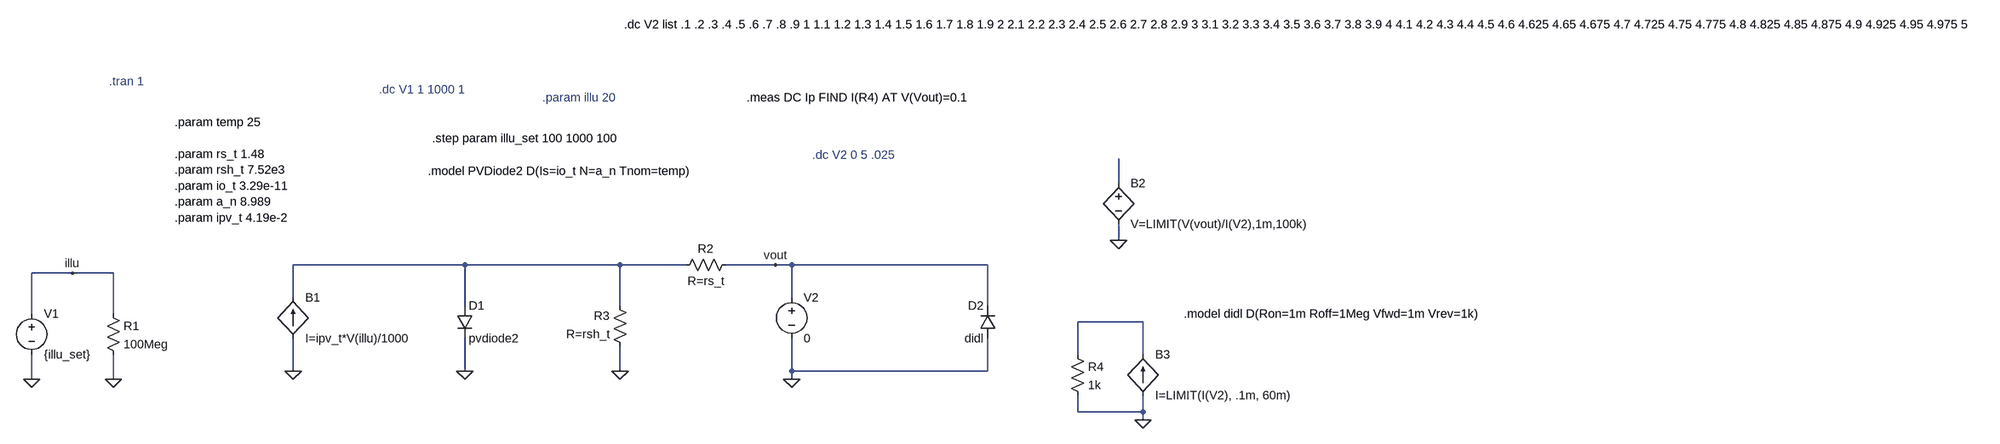
[diagram p0: schematic SM101K07L_Model.asc]
SM101K07L_Model.asc, the LTspice schematic file:
Version 4
SHEET 1 4508 756
WIRE 2256 -80 2256 -128
WIRE 2256 32 2256 0
WIRE 976 80 640 80
WIRE 1280 80 976 80
WIRE 1408 80 1280 80
WIRE 1584 80 1488 80
WIRE 1616 80 1584 80
WIRE 2000 80 1616 80
WIRE 208 96 128 96
WIRE 288 96 208 96
WIRE 640 144 640 80
WIRE 1616 144 1616 80
WIRE 976 160 976 80
WIRE 1280 160 1280 80
WIRE 2000 160 2000 80
WIRE 128 176 128 96
WIRE 288 176 288 96
WIRE 2304 192 2176 192
WIRE 2176 256 2176 192
WIRE 2304 256 2304 192
WIRE 640 288 640 224
WIRE 976 288 976 224
WIRE 1280 288 1280 240
WIRE 1616 288 1616 224
WIRE 2000 288 2000 224
WIRE 2000 288 1616 288
WIRE 128 304 128 256
WIRE 288 304 288 256
WIRE 1616 304 1616 288
WIRE 2176 368 2176 336
WIRE 2304 368 2304 336
WIRE 2304 368 2176 368
WIRE 2304 384 2304 368
FLAG 128 304 0
FLAG 288 304 0
FLAG 208 96 illu
FLAG 1616 304 0
FLAG 1280 288 0
FLAG 976 288 0
FLAG 640 288 0
FLAG 1584 80 vout
FLAG 2256 32 0
FLAG 2304 384 0
SYMBOL voltage 128 160 R0
WINDOW 123 0 0 Left 0
WINDOW 39 0 0 Left 0
SYMATTR InstName V1
SYMATTR Value {illu_set}
SYMBOL res 272 160 R0
SYMATTR InstName R1
SYMATTR Value 100Meg
SYMBOL res 1504 64 R90
WINDOW 0 0 56 VBottom 2
WINDOW 3 32 56 VTop 2
SYMATTR InstName R2
SYMATTR Value R=rs_t
SYMBOL res 1296 256 R180
WINDOW 0 36 76 Left 2
WINDOW 3 36 40 Left 2
SYMATTR InstName R3
SYMATTR Value R=rsh_t
SYMBOL diode 960 160 R0
SYMATTR InstName D1
SYMATTR Value pvdiode2
SYMBOL bi2 640 144 R0
SYMATTR InstName B1
SYMATTR Value I=ipv_t*V(illu)/1000
SYMBOL diode 2016 224 R180
WINDOW 0 24 64 Left 2
WINDOW 3 24 0 Left 2
SYMATTR InstName D2
SYMATTR Value didl
SYMBOL bv 2256 -96 R0
SYMATTR InstName B2
SYMATTR Value V=LIMIT(V(vout)/I(V2),1m,100k)
SYMBOL voltage 1616 128 R0
WINDOW 123 0 0 Left 0
WINDOW 39 0 0 Left 0
SYMATTR InstName V2
SYMATTR Value 0
SYMBOL bi 2304 336 M180
WINDOW 0 24 80 Left 2
WINDOW 3 24 0 Left 2
SYMATTR InstName B3
SYMATTR Value I=LIMIT(I(V2), .1m, 60m)
SYMBOL res 2160 240 R0
SYMATTR InstName R4
SYMATTR Value 1k
TEXT 904 -104 Left 2 !.model PVDiode2 D(Is=io_t N=a_n Tnom=temp)
TEXT 408 -200 Left 2 !.param temp 25\n \n.param rs_t 1.48\n.param rsh_t 7.52e3\n.param io_t 3.29e-11\n.param a_n 8.989\n.param ipv_t 4.19e-2
TEXT 912 -168 Left 2 !.step param illu_set 100 1000 100
TEXT 280 -280 Left 2 ;.tran 1
TEXT 1128 -248 Left 2 ;.param illu 20
TEXT 1528 -248 Left 2 !.meas DC Ip FIND I(R4) AT V(Vout)=0.1
TEXT 808 -264 Left 2 ;.dc V1 1 1000 1
TEXT 2384 176 Left 2 !.model didl D(Ron=1m Roff=1Meg Vfwd=1m Vrev=1k)
TEXT 1656 -136 Left 2 ;.dc V2 0 5 .025
TEXT 1288 -392 Left 2 !.dc V2 list .1 .2 .3 .4 .5 .6 .7 .8 .9 1 1.1 1.2 1.3 1.4 1.5 1.6 1.7 1.8 1.9 2 2.1 2.2 2.3 2.4 2.5 2.6 2.7 2.8 2.9 3 3.1 3.2 3.3 3.4 3.5 3.6 3.7 3.8 3.9 4 4.1 4.2 4.3 4.4 4.5 4.6 4.625 4.65 4.675 4.7 4.725 4.75 4.775 4.8 4.825 4.85 4.875 4.9 4.925 4.95 4.975 5

The netlist it stands for:
* SM101K07L_Model.asc
V1 illu 0 {illu_set}
R1 illu 0 100Meg
R2 vout N002 R=rs_t
R3 0 N002 R=rsh_t
D1 N002 0 pvdiode2
B1 0 N002 I=ipv_t*V(illu)/1000
D2 0 vout didl
B2 N001 0 V=LIMIT(V(vout)/I(V2),1m,100k)
V2 vout 0 0
B3 0 N003 I=LIMIT(I(V2), .1m, 60m)
R4 N003 0 1k
.model D D
.lib standard.dio
.model PVDiode2 D(Is=io_t N=a_n Tnom=temp)
.param temp 25
.param rs_t 1.48
.param rsh_t 7.52e3
.param io_t 3.29e-11
.param a_n 8.989
.param ipv_t 4.19e-2
.step param illu_set 100 1000 100
* .tran 1
* .param illu 20
.meas DC Ip FIND I(R4) AT V(Vout)=0.1
* .dc V1 1 1000 1
.model didl D(Ron=1m Roff=1Meg Vfwd=1m Vrev=1k)
* .dc V2 0 5 .025
.dc V2 list .1 .2 .3 .4 .5 .6 .7 .8 .9 1 1.1 1.2 1.3 1.4 1.5 1.6 1.7 1.8 1.9 2 2.1 2.2 2.3 2.4 2.5 2.6 2.7 2.8 2.9 3 3.1 3.2 3.3 3.4 3.5 3.6 3.7 3.8 3.9 4 4.1 4.2 4.3 4.4 4.5 4.6 4.625 4.65 4.675 4.7 4.725 4.75 4.775 4.8 4.825 4.85 4.875 4.9 4.925 4.95 4.975 5
.backanno
.end